# Altium schematic sheet Targets.SchDoc: Shepherd - Target Interface
size A3; Author: Ingmar; CompanyName: NES Lab / TU Dresden; DocumentNumber: 7; SheetNumber: 7; SheetTotal: 8
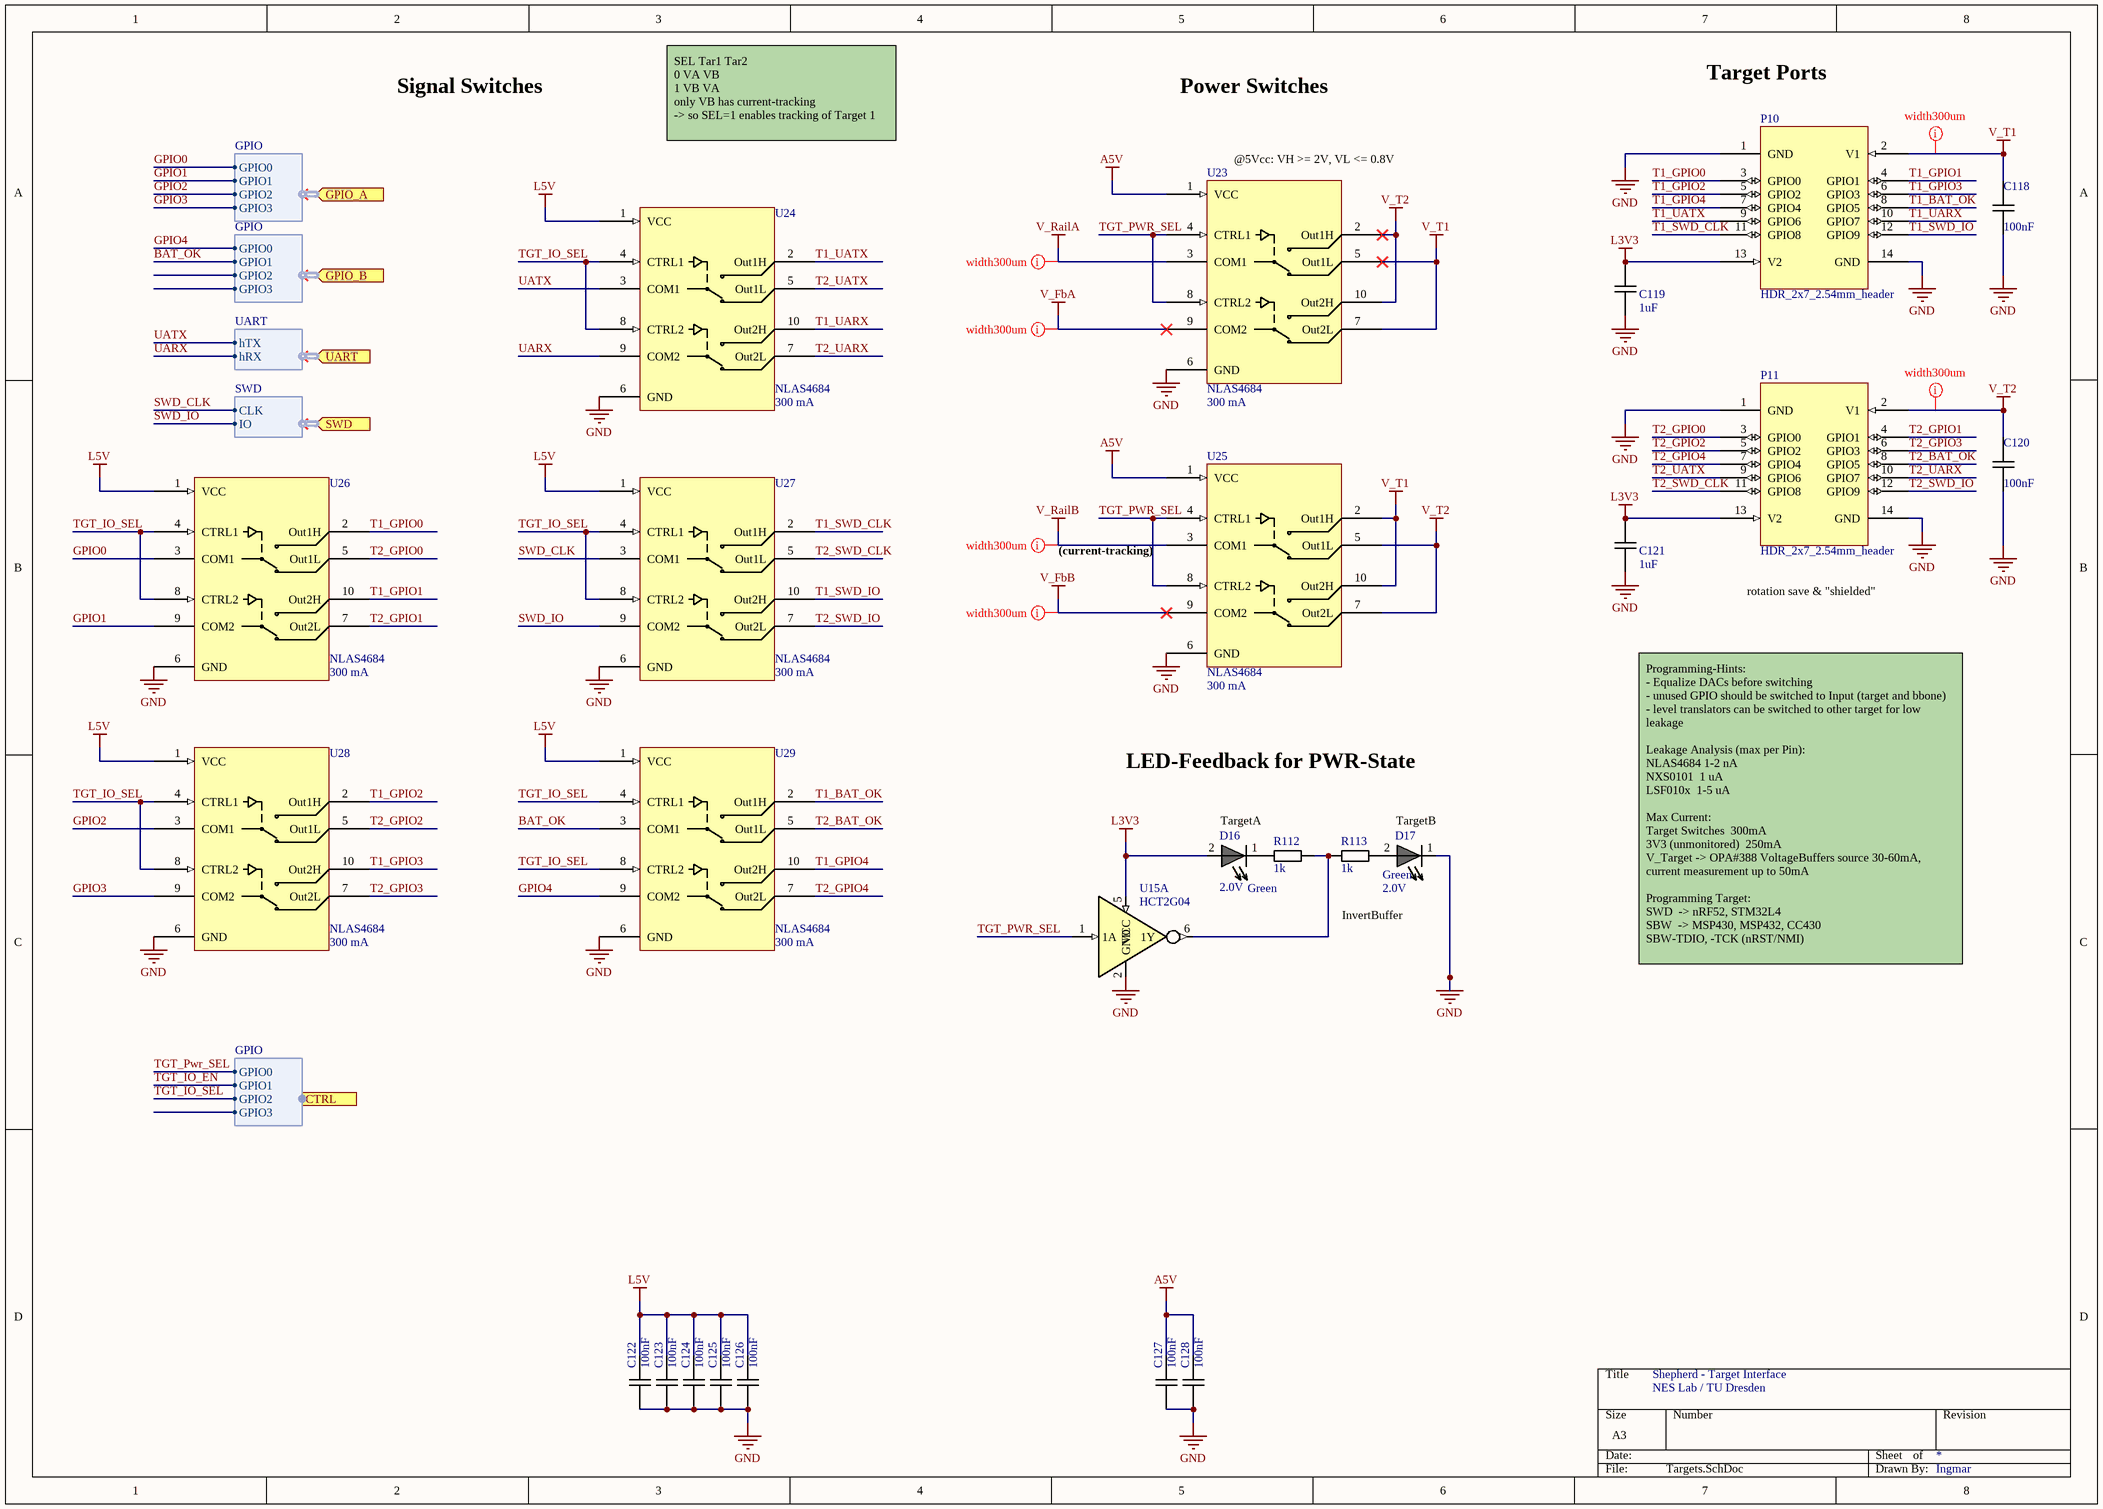
[diagram p0: Targets.SchDoc]

## Parts
C118  value 100nF  [CAPC1005X06]  (hidden comment: C_0402_100nF_16V)
C119  value 1uF  [CAPC1005X06]  (hidden comment: C_0402_1uF_25V)
C120  value 100nF  [CAPC1005X06]  (hidden comment: C_0402_100nF_16V)
C121  value 1uF  [CAPC1005X06]  (hidden comment: C_0402_1uF_25V)
C122  value 100nF  [CAPC1005X06]  (hidden comment: C_0402_100nF_16V)
C123  value 100nF  [CAPC1005X06]  (hidden comment: C_0402_100nF_16V)
C124  value 100nF  [CAPC1005X06]  (hidden comment: C_0402_100nF_16V)
C125  value 100nF  [CAPC1005X06]  (hidden comment: C_0402_100nF_16V)
C126  value 100nF  [CAPC1005X06]  (hidden comment: C_0402_100nF_16V)
C127  value 100nF  [CAPC1005X06]  (hidden comment: C_0402_100nF_16V)
C128  value 100nF  [CAPC1005X06]  (hidden comment: C_0402_100nF_16V)
D16  value Green  V_max: 2.0V  [DIOM1608X02N Green]  (hidden comment: D_LED_0603_Green)
D17  value Green  V_max: 2.0V  [DIOM1608X02N Green]  (hidden comment: D_LED_0603_Green)
P10  HDR_2x7_2.54mm_header  [P_Pinheader_2x7_R2.54mm_target]
P11  HDR_2x7_2.54mm_header  [P_Pinheader_2x7_R2.54mm_male]
R112  value 1k  [RESC1005X04]  (hidden comment: R_0402_1k)
R113  value 1k  [RESC1005X04]  (hidden comment: R_0402_1k)
U15  HCT2G04  [SOT65P210X110-6N]  (part A of 2)
U23  NLAS4684  I_max: 300 mA  [PSON50P300X100_HS-11N]
U24  NLAS4684  I_max: 300 mA  [PSON50P300X100_HS-11N]
U25  NLAS4684  I_max: 300 mA  [PSON50P300X100_HS-11N]
U26  NLAS4684  I_max: 300 mA  [PSON50P300X100_HS-11N]
U27  NLAS4684  I_max: 300 mA  [PSON50P300X100_HS-11N]
U28  NLAS4684  I_max: 300 mA  [PSON50P300X100_HS-11N]
U29  NLAS4684  I_max: 300 mA  [PSON50P300X100_HS-11N]

## Ports
CTRL (in, harness GPIO), GPIO_A (in, harness GPIO), GPIO_B (in, harness GPIO), SWD (in, harness SWD), UART (in, harness UART)

## Harnesses
GPIO: GPIO0, GPIO1, GPIO2, GPIO3
SWD: CLK, IO
UART: hTX, hRX

## Nets
A5V: C127.2 C128.2 U23.1(VCC) U25.1(VCC)
GND: C118.1 C119.1 C120.1 C121.1 C122.1 C123.1 C124.1 C125.1 C126.1 C127.1 C128.1 D17.1 P10.1(GND) P10.14(GND) P11.1(GND) P11.14(GND) U15.2(GND) U23.6(GND) U24.6(GND) U25.6(GND) U26.6(GND) U27.6(GND) U28.6(GND) U29.6(GND)
L3V3: C119.2 C121.2 D16.2 P10.13(V2) P11.13(V2) U15.5(VCC)
L5V: C122.2 C123.2 C124.2 C125.2 C126.2 U24.1(VCC) U26.1(VCC) U27.1(VCC) U28.1(VCC) U29.1(VCC)
V_FbA: U23.9(COM2)
V_FbB: U25.9(COM2)
V_RailA: U23.3(COM1)
V_RailB: U25.3(COM1)
V_T1: C118.2 P10.2(V1) U23.5(Out1L) U23.7(Out2L) U25.2(Out1H) U25.10(Out2H)
V_T2: C120.2 P11.2(V1) U23.2(Out1H) U23.10(Out2H) U25.5(Out1L) U25.7(Out2L)
BAT_OK: U29.3(COM1) ; port GPIO_B.GPIO1
GPIO0: U26.3(COM1) ; port GPIO_A.GPIO0
GPIO1: U26.9(COM2) ; port GPIO_A.GPIO1
GPIO2: U28.3(COM1) ; port GPIO_A.GPIO2
GPIO3: U28.9(COM2) ; port GPIO_A.GPIO3
GPIO4: U29.9(COM2) ; port GPIO_B.GPIO0
SWD_CLK: U27.3(COM1) ; port SWD.CLK
SWD_IO: U27.9(COM2) ; port SWD.IO
T1_BAT_OK: P10.8(GPIO5) U29.2(Out1H)
T1_GPIO0: P10.3(GPIO0) U26.2(Out1H)
T1_GPIO1: P10.4(GPIO1) U26.10(Out2H)
T1_GPIO2: P10.5(GPIO2) U28.2(Out1H)
T1_GPIO3: P10.6(GPIO3) U28.10(Out2H)
T1_GPIO4: P10.7(GPIO4) U29.10(Out2H)
T1_SWD_CLK: P10.11(GPIO8) U27.2(Out1H)
T1_SWD_IO: P10.12(GPIO9) U27.10(Out2H)
T1_UARX: P10.10(GPIO7) U24.10(Out2H)
T1_UATX: P10.9(GPIO6) U24.2(Out1H)
T2_BAT_OK: P11.8(GPIO5) U29.5(Out1L)
T2_GPIO0: P11.3(GPIO0) U26.5(Out1L)
T2_GPIO1: P11.4(GPIO1) U26.7(Out2L)
T2_GPIO2: P11.5(GPIO2) U28.5(Out1L)
T2_GPIO3: P11.6(GPIO3) U28.7(Out2L)
T2_GPIO4: P11.7(GPIO4) U29.7(Out2L)
T2_SWD_CLK: P11.11(GPIO8) U27.5(Out1L)
T2_SWD_IO: P11.12(GPIO9) U27.7(Out2L)
T2_UARX: P11.10(GPIO7) U24.7(Out2L)
T2_UATX: P11.9(GPIO6) U24.5(Out1L)
TGT_IO_EN: port CTRL.GPIO1
TGT_IO_SEL: U24.4(CTRL1) U24.8(CTRL2) U26.4(CTRL1) U26.8(CTRL2) U27.4(CTRL1) U27.8(CTRL2) U28.4(CTRL1) U28.8(CTRL2) U29.4(CTRL1) U29.8(CTRL2) ; port CTRL.GPIO2
TGT_PWR_SEL: U15.1(1A) U23.4(CTRL1) U23.8(CTRL2) U25.4(CTRL1) U25.8(CTRL2) ; port CTRL.GPIO0
UARX: U24.9(COM2) ; port UART.hRX
UATX: U24.3(COM1) ; port UART.hTX
NetD16_1: D16.1 R112.1
NetD17_2: D17.2 R113.1
NetR112_2: R112.2 R113.2 U15.6(1Y)

## Layout directives
rule Width Constraint [Pref Width = 0.3mm    Min Width = 0.3mm    Max Width = 1mm]: V_FbA, V_FbB, V_RailA, V_RailB, V_T1, V_T2

## Notes on the sheet
- Signal Switches
- Power Switches
- Target Ports
- SEL	Tar1	Tar2
  0	VA	VB
  1	VB	VA
  only VB has current-tracking
  -> so SEL=1 enables tracking of Target 1
- (near U23) @5Vcc: VH >= 2V, VL <= 0.8V
- (near U25) (current-tracking)
- rotation save & "shielded"
- LED-Feedback for PWR-State
- TargetA
- TargetB
- InvertBuffer
- Programming-Hints:
  - Equalize DACs before switching
  - unused GPIO should be switched to Input (target and bbone)
  - level translators can be switched to other target for low leakage
  Leakage Analysis (max per Pin):
  NLAS4684	1-2 nA
  NXS0101		1 uA
  LSF010x		1-5 uA
  Max Current:
  Target Switches 	300mA
  3V3 (unmonitored) 	250mA
  V_Target -> OPA#388 VoltageBuffers source 30-60mA, current measurement up to 50mA
  Programming Target:
  SWD 	-> nRF52, STM32L4
  SBW 	-> MSP430, MSP432, CC430
  SBW-TDIO, -TCK (nRST/NMI)

## Library data of the parts
C118 C120 C122-C128 = .C_0402_100nF_16V: Capacitor; Manufacturer: Taiyo Yuden; Manufacturer PN: EMF105B7104MVHF; V_max: 16V; Tolerance: 20%; Dielectric: X7R; Distributer: Mouser; Distributer PN: 963-EMF105B7104MVHF; Price n10 [€]: 0.03
C119 C121 = .C_0402_1uF_25V: Capacitor; Manufacturer: Murata; Manufacturer PN: GRM155R61E105KA12J; V_max: 25V; Tolerance: 10%; Dielectric: X5R; Distributer: Mouser; Distributer PN: 81-GRM155R61E105KA2J; Price n10 [€]: 0.06
D16 D17 = .D_LED_0603_Green: LED YellowGreen 575nm, 0603, 60mcd 2V@20mA; Manufacturer: Wuerth; Manufacturer PN: 150060VS55040; I_max: 20mA; I_typ: 5mA; V_typ: 1.85V; Distributer: Mouser; Distributer PN: 710-150060VS55040; Price n10 [€]: 0.14
P10 P11 = .P_HDR_2x7_2.54mm_male: Gold, Straight; Manufacturer: Amphenol FCI; Manufacturer PN: 10129381-914004BLF; I_max: 3A; V_max: 110V; Distributer: Mouser; Distributer PN: 649-1012938191404BLF; Price n10 [€]: 0.19
R112 R113 = .R_0402_1k: Resistor; Manufacturer: Panasonic; Manufacturer PN: ERJ-2GEJ102X; P_max: 100mW; V_max: 50V; Tolerance: 5%; Distributer: Mouser; Distributer PN: 667-ERJ-2GEJ102X; Price n10 [€]: 0.02
U15 = HCT2G04: Inverter Dual, Buffered, I_out +- 25mA max,; Manufacturer: Nexperia; Manufacturer PN: 74HC2G04GW,125; V_max: 6.0V; V_min: 2.0V; I_max: 400uA; Distributer: Mouser; Distributer PN: 771-HC2G04GW125; Price n10 [€]: 0.21
U23-U29 = NLAS4684-MN: Analog Switch, Dual SPDT, 500 mOhm Rds, 300 mA continuous, 500 mA peak, <10 nA Leakage (1 nA for -55 to 25°C); Manufacturer: ON Semi; Manufacturer PN: NLAS4684MNR2G; V_max: 5.5; V_min: 1.8V; Distributer: Mouser; Distributer PN: 863-NLAS4684MNR2G; Price n10 [€]: 0.63